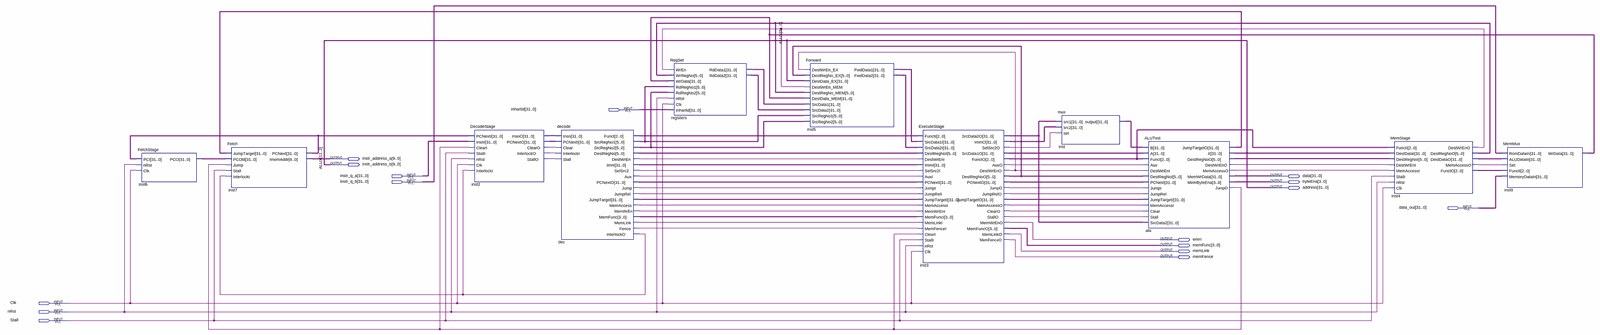
[diagram p0: schematic sheet, whole]
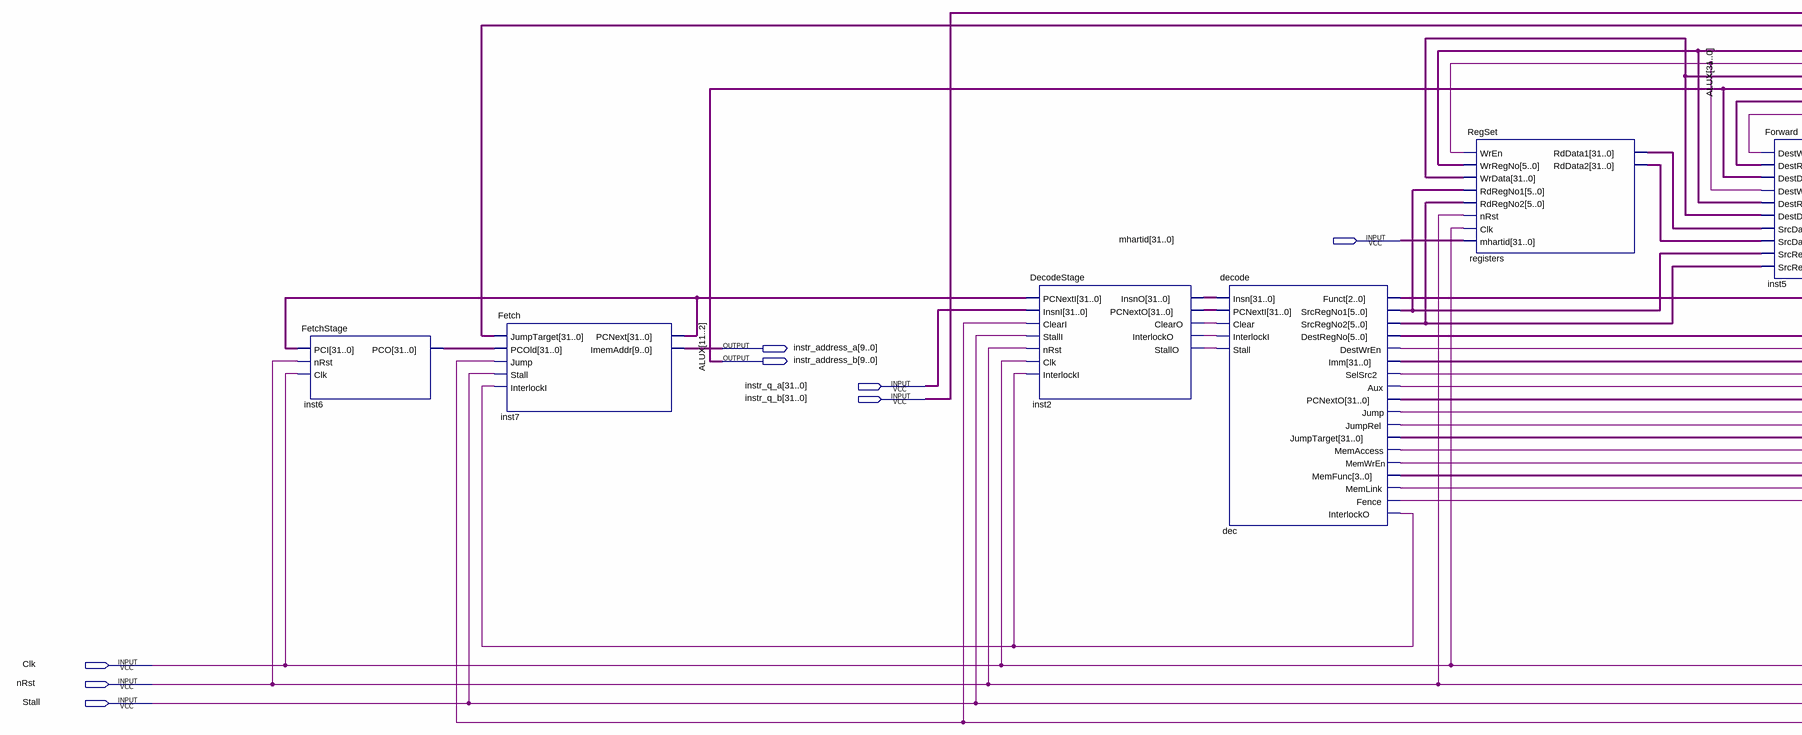
[diagram p1: schematic sheet, left part]
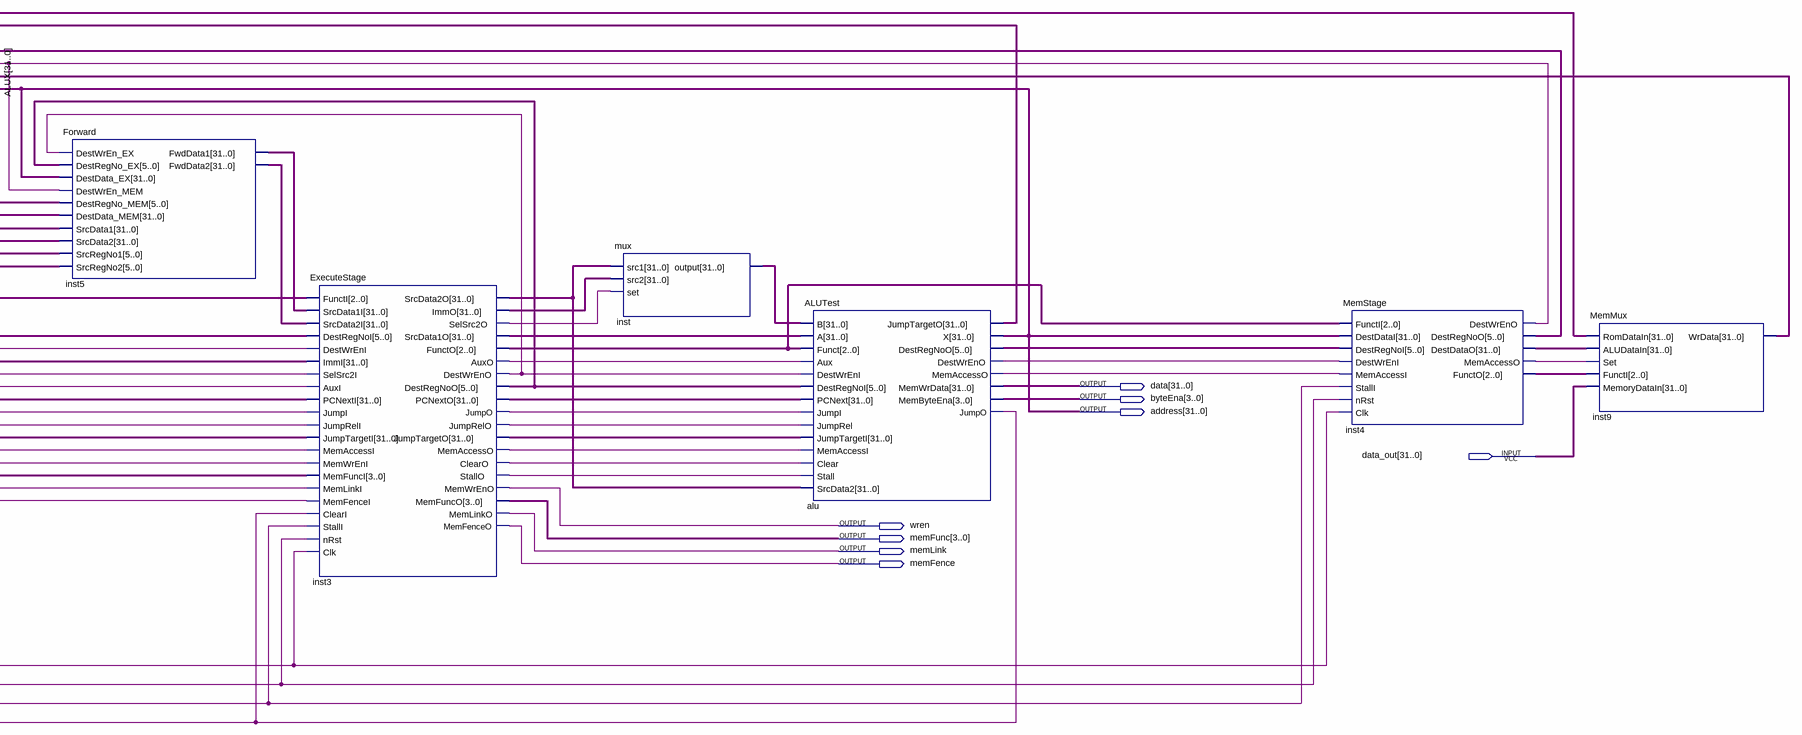
[diagram p2: schematic sheet, right part]
// Quartus schematic core.bdf as structural Verilog: 11 symbols, 16 pins
module core (
  input  [31:0] mhartid,
  input  [31:0] instr_q_a,
  input  [31:0] instr_q_b,
  input  [31:0] data_out,
  input  Clk,
  input  nRst,
  input  Stall,
  output [9:0] instr_address_a,
  output [9:0] instr_address_b,
  output [31:0] data,
  output [3:0] byteEna,
  output [31:0] address,
  output wren,
  output [3:0] memFunc,
  output memLink,
  output memFence
);

  wire alu_destwreno, alu_jumpo, alu_memaccesso, dec_aux, dec_destwren, dec_fence, dec_interlocko, dec_jump,
       dec_jumprel, dec_memaccess, dec_memlink, dec_memwren, dec_selsrc2, inst2_clearo, inst2_interlocko,
       inst2_stallo, inst3_auxo, inst3_clearo, inst3_destwreno, inst3_jumpo, inst3_jumprelo,
       inst3_memaccesso, inst3_selsrc2o, inst3_stallo, inst4_destwreno, inst4_memaccesso;
  wire [2:0] dec_funct, inst3_functo, inst4_functo;
  wire [3:0] dec_memfunc;
  wire [5:0] alu_destregnoo, dec_destregno, dec_srcregno1, dec_srcregno2, inst3_destregnoo, inst4_destregnoo;
  wire [31:0] alu_jumptargeto, dec_imm, dec_jumptarget, dec_pcnexto, inst2_insno, inst2_pcnexto, inst3_immo,
       inst3_jumptargeto, inst3_pcnexto, inst3_srcdata1o, inst3_srcdata2o, inst4_destdatao, inst5_fwddata1,
       inst5_fwddata2, inst6_pco, inst7_pcnext, inst9_wrdata, inst_output, registers_rddata1,
       registers_rddata2;

  FetchStage inst6 (.PCI(inst7_pcnext), .nRst(nRst), .Clk(Clk), .PCO(inst6_pco));
  Fetch inst7 (
    .JumpTarget(alu_jumptargeto), .PCOld(inst6_pco), .Jump(alu_jumpo), .Stall(Stall),
    .InterlockI(dec_interlocko), .PCNext(inst7_pcnext), .ImemAddr(instr_address_a));
  DecodeStage inst2 (
    .PCNextI(inst7_pcnext), .InsnI(instr_q_a), .ClearI(alu_jumpo), .StallI(Stall), .nRst(nRst), .Clk(Clk),
    .InterlockI(dec_interlocko), .InsnO(inst2_insno), .PCNextO(inst2_pcnexto), .ClearO(inst2_clearo),
    .InterlockO(inst2_interlocko), .StallO(inst2_stallo));
  decode dec (
    .Insn(inst2_insno), .PCNextI(inst2_pcnexto), .Clear(inst2_clearo), .InterlockI(inst2_interlocko),
    .Stall(inst2_stallo), .Funct(dec_funct), .SrcRegNo1(dec_srcregno1), .SrcRegNo2(dec_srcregno2),
    .DestRegNo(dec_destregno), .DestWrEn(dec_destwren), .Imm(dec_imm), .SelSrc2(dec_selsrc2), .Aux(dec_aux),
    .PCNextO(dec_pcnexto), .Jump(dec_jump), .JumpRel(dec_jumprel), .JumpTarget(dec_jumptarget),
    .MemAccess(dec_memaccess), .MemWrEn(dec_memwren), .MemFunc(dec_memfunc), .MemLink(dec_memlink),
    .Fence(dec_fence), .InterlockO(dec_interlocko));
  RegSet registers (
    .WrEn(inst4_destwreno), .WrRegNo(inst4_destregnoo), .WrData(inst9_wrdata), .RdRegNo1(dec_srcregno1),
    .RdRegNo2(dec_srcregno2), .nRst(nRst), .Clk(Clk), .mhartid(mhartid), .RdData1(registers_rddata1),
    .RdData2(registers_rddata2));
  Forward inst5 (
    .DestWrEn_EX(inst3_destwreno), .DestRegNo_EX(inst3_destregnoo), .DestData_EX(address),
    .DestWrEn_MEM(inst4_destwreno), .DestRegNo_MEM(inst4_destregnoo), .DestData_MEM(inst9_wrdata),
    .SrcData1(registers_rddata1), .SrcData2(registers_rddata2), .SrcRegNo1(dec_srcregno1),
    .SrcRegNo2(dec_srcregno2), .FwdData1(inst5_fwddata1), .FwdData2(inst5_fwddata2));
  ExecuteStage inst3 (
    .FunctI(dec_funct), .SrcData1I(inst5_fwddata1), .SrcData2I(inst5_fwddata2), .DestRegNoI(dec_destregno),
    .DestWrEnI(dec_destwren), .ImmI(dec_imm), .SelSrc2I(dec_selsrc2), .AuxI(dec_aux), .PCNextI(dec_pcnexto),
    .JumpI(dec_jump), .JumpRelI(dec_jumprel), .JumpTargetI(dec_jumptarget), .MemAccessI(dec_memaccess),
    .MemWrEnI(dec_memwren), .MemFuncI(dec_memfunc), .MemLinkI(dec_memlink), .MemFenceI(dec_fence),
    .ClearI(alu_jumpo), .StallI(Stall), .nRst(nRst), .Clk(Clk), .SrcData2O(inst3_srcdata2o),
    .ImmO(inst3_immo), .SelSrc2O(inst3_selsrc2o), .SrcData1O(inst3_srcdata1o), .FunctO(inst3_functo),
    .AuxO(inst3_auxo), .DestWrEnO(inst3_destwreno), .DestRegNoO(inst3_destregnoo), .PCNextO(inst3_pcnexto),
    .JumpO(inst3_jumpo), .JumpRelO(inst3_jumprelo), .JumpTargetO(inst3_jumptargeto),
    .MemAccessO(inst3_memaccesso), .ClearO(inst3_clearo), .StallO(inst3_stallo), .MemWrEnO(wren),
    .MemFuncO(memFunc), .MemLinkO(memLink), .MemFenceO(memFence));
  mux inst (.src1(inst3_srcdata2o), .src2(inst3_immo), .set(inst3_selsrc2o), .\output (inst_output));
  ALUTest alu (
    .B(inst_output), .A(inst3_srcdata1o), .Funct(inst3_functo), .Aux(inst3_auxo),
    .DestWrEnI(inst3_destwreno), .DestRegNoI(inst3_destregnoo), .PCNext(inst3_pcnexto), .JumpI(inst3_jumpo),
    .JumpRel(inst3_jumprelo), .JumpTargetI(inst3_jumptargeto), .MemAccessI(inst3_memaccesso),
    .Clear(inst3_clearo), .Stall(inst3_stallo), .SrcData2(inst3_srcdata2o), .JumpTargetO(alu_jumptargeto),
    .X(address), .DestRegNoO(alu_destregnoo), .DestWrEnO(alu_destwreno), .MemAccessO(alu_memaccesso),
    .MemWrData(data), .MemByteEna(byteEna), .JumpO(alu_jumpo));
  MemStage inst4 (
    .FunctI(inst3_functo), .DestDataI(address), .DestRegNoI(alu_destregnoo), .DestWrEnI(alu_destwreno),
    .MemAccessI(alu_memaccesso), .StallI(Stall), .nRst(nRst), .Clk(Clk), .DestWrEnO(inst4_destwreno),
    .DestRegNoO(inst4_destregnoo), .DestDataO(inst4_destdatao), .MemAccessO(inst4_memaccesso),
    .FunctO(inst4_functo));
  MemMux inst9 (
    .RomDataIn(instr_q_b), .ALUDataIn(inst4_destdatao), .Set(inst4_memaccesso), .FunctI(inst4_functo),
    .MemoryDataIn(data_out), .WrData(inst9_wrdata));

  assign instr_address_b = address[11:2];

  // Other names for the same wires on the sheet: ALUX[31:0] = address
endmodule
